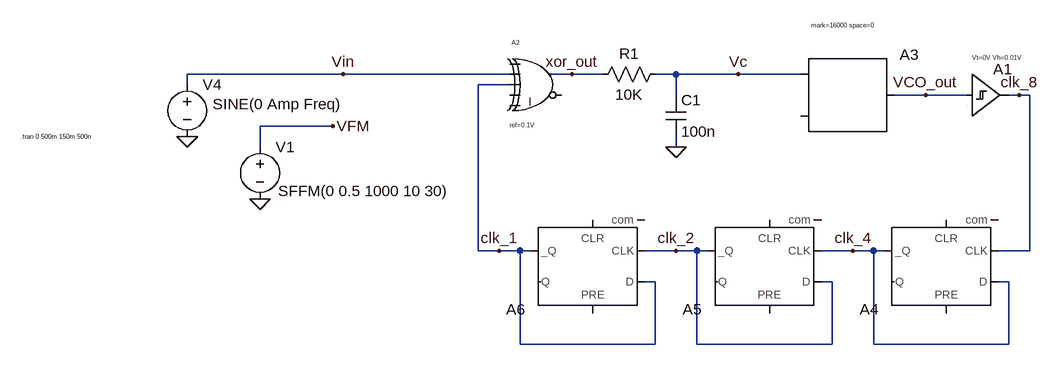
[diagram p0: schematic frequency_multiplier_pll_ltspice.asc]
frequency_multiplier_pll_ltspice.asc, the LTspice schematic file:
Version 4
SHEET 1 2752 680
WIRE -896 -480 -1136 -480
WIRE -640 -480 -896 -480
WIRE -544 -480 -576 -480
WIRE -496 -480 -544 -480
WIRE -384 -480 -416 -480
WIRE -288 -480 -384 -480
WIRE -192 -480 -288 -480
WIRE -1136 -464 -1136 -480
WIRE -640 -464 -688 -464
WIRE -384 -448 -384 -480
WIRE 0 -448 -48 -448
WIRE 64 -448 0 -448
WIRE 144 -448 128 -448
WIRE 160 -448 144 -448
WIRE -912 -400 -1024 -400
WIRE -1024 -368 -1024 -400
WIRE -384 -368 -384 -384
WIRE -688 -208 -688 -464
WIRE -656 -208 -688 -208
WIRE -624 -208 -656 -208
WIRE -608 -208 -624 -208
WIRE -384 -208 -432 -208
WIRE -352 -208 -384 -208
WIRE -336 -208 -352 -208
WIRE -112 -208 -160 -208
WIRE -80 -208 -112 -208
WIRE -64 -208 -80 -208
WIRE 160 -208 160 -448
WIRE 160 -208 112 -208
WIRE -416 -160 -432 -160
WIRE -144 -160 -160 -160
WIRE 128 -160 112 -160
WIRE -624 -64 -624 -208
WIRE -416 -64 -416 -160
WIRE -416 -64 -624 -64
WIRE -352 -64 -352 -208
WIRE -144 -64 -144 -160
WIRE -144 -64 -352 -64
WIRE -80 -64 -80 -208
WIRE 128 -64 128 -160
WIRE 128 -64 -80 -64
FLAG -1024 -288 0
FLAG -384 -368 0
FLAG -544 -480 xor_out
FLAG 0 -448 VCO_out
FLAG -288 -480 Vc
FLAG -112 -208 clk_4
FLAG -384 -208 clk_2
FLAG -656 -208 clk_1
FLAG 144 -448 clk_8
FLAG -1136 -384 0
FLAG -896 -480 Vin
FLAG -912 -400 VFM
SYMBOL Digital\\xor -592 -528 R0
WINDOW 3 -48 126 Left 0
WINDOW 0 -45 -1 Left 0
SYMATTR Value ref=0.1V
SYMATTR InstName A2
SYMBOL cap -400 -448 R0
SYMATTR InstName C1
SYMATTR Value 100n
SYMBOL SpecialFunctions\\modulate -192 -480 R0
WINDOW 3 16 -76 Left 0
SYMATTR Value mark=16000 space=0
SYMATTR InstName A3
SYMBOL voltage -1024 -384 R0
WINDOW 123 0 0 Left 0
WINDOW 39 0 0 Left 0
WINDOW 3 28 84 Left 2
SYMATTR InstName V1
SYMATTR Value SFFM(0 0.5 1000 10 30)
SYMBOL Digital\\schmtbuf 64 -512 R0
WINDOW 3 8 6 Left 0
SYMATTR Value Vt=0V Vh=0.01V
SYMATTR InstName A1
SYMBOL Digital\\dflop 32 -112 R180
SYMATTR InstName A4
SYMBOL Digital\\dflop -240 -112 R180
SYMATTR InstName A5
SYMBOL Digital\\dflop -512 -112 R180
SYMATTR InstName A6
SYMBOL res -400 -496 R90
WINDOW 0 0 56 VBottom 2
WINDOW 3 32 56 VTop 2
SYMATTR InstName R1
SYMATTR Value 10K
SYMBOL voltage -1136 -480 R0
WINDOW 123 0 0 Left 0
WINDOW 39 0 0 Left 0
WINDOW 3 39 46 Left 2
SYMATTR InstName V4
SYMATTR Value SINE(0 Amp Freq)
TEXT -1392 -384 Left 0 !.tran 0 500m 150m 500n

The netlist it stands for:
* frequency_multiplier_pll_ltspice.asc
A2 0 Vin clk_1 0 0 0 xor_out 0 XOR ref=0.1V
C1 Vc 0 100n
A3 Vc 0 0 0 0 0 VCO_out 0 MODULATOR mark=16000 space=0
V1 VFM 0 SFFM(0 0.5 1000 10 30)
A1 VCO_out 0 0 0 0 0 clk_8 0 SCHMITT Vt=0V Vh=0.01V
A4 clk_4 0 clk_8 0 0 clk_4 0 0 DFLOP
A5 clk_2 0 clk_4 0 0 clk_2 0 0 DFLOP
A6 clk_1 0 clk_2 0 0 clk_1 0 0 DFLOP
R1 Vc xor_out 10K
V4 Vin 0 SINE(0 Amp Freq)
.tran 0 500m 150m 500n
.backanno
.end